# Altium schematic sheet SC945D_SD_Card.SchDoc: SD Card
size 393 x 270 mm; CompanyName: Seccom; Address1: 521, rue du capt. François Garbit; Address2: 69440 Mornant; Address3: seccom@seccom.fr; Address4: www.seccom.fr; DocumentNumber: 5; SheetNumber: 5; SheetTotal: 9; PageSetup: Record=PageOptions|CenterHorizontal=True|CenterVertical=True|PrintScale=0.74|XCorrection=1.00|YCorrection=1.00|PrintKind=0|BorderSize=5000000|LeftOffset=0|BottomOffset=0|Orientation=2|PaperLength=1000|PaperWidth=1000|Scale=100|PaperSource=7|PrintQuality=-4|MediaType=1|DitherType=10|PaperKind=A4|PrintScaleMode=1
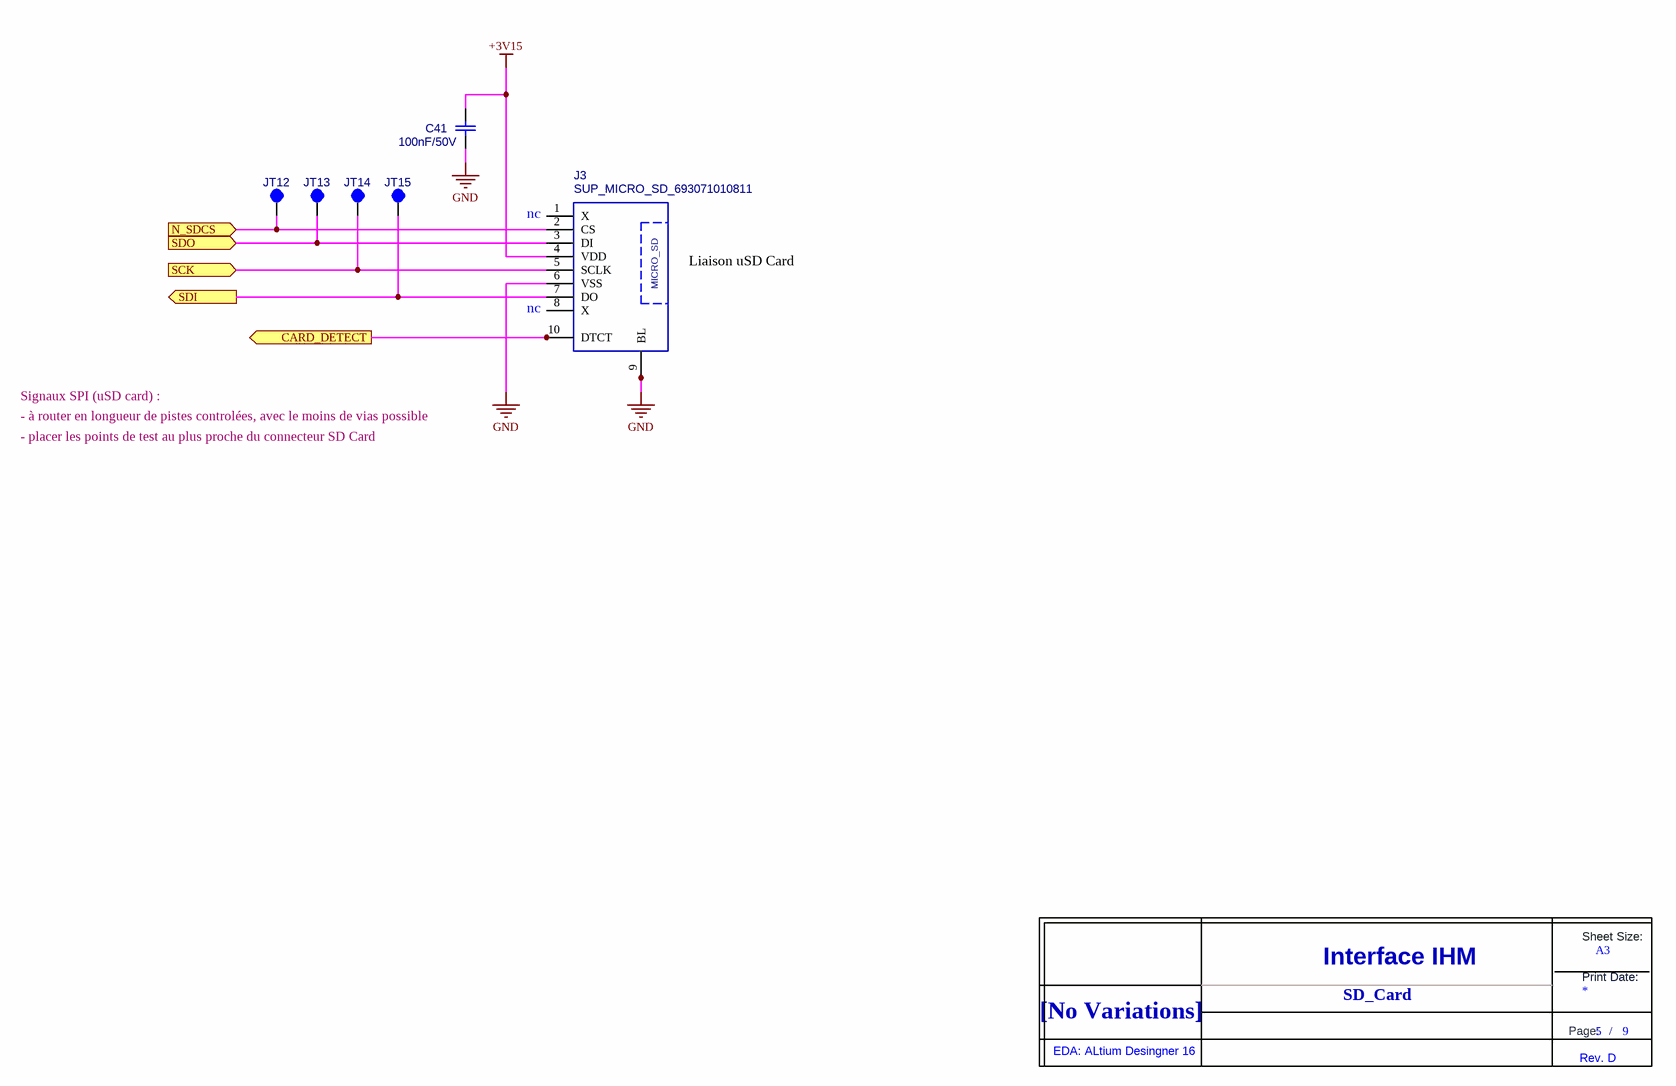
[diagram p0: SC945D_SD_Card.SchDoc]

## Parts
C41  value 100nF/50V  [0603_ReflowSoldering_CAP]  (hidden comment: C_0603_X7R_10%_100N-50V)
J3  value SUP_MICRO_SD_693071010811  [SUP_MICRO_SD_BL_PUSH-PUSH_693071010811+USD]  (hidden comment: SUP_MICRO_SD_CARD_BL_PUSH-PUSH_693071010811)
JT12  PAD_CMS_20X20_E  [PAD_CMS_20X20_E]  (value not drawn)  (no BOM)
JT13  PAD_CMS_20X20_E  [PAD_CMS_20X20_E]  (value not drawn)  (no BOM)
JT14  PAD_CMS_20X20_E  [PAD_CMS_20X20_E]  (value not drawn)  (no BOM)
JT15  PAD_CMS_20X20_E  [PAD_CMS_20X20_E]  (value not drawn)  (no BOM)
Title_new?  DNI  (value not drawn)  (graphical)

## Ports
CARD_DETECT (out), N_SDCS (in), SCK (in), SDI (out), SDO (in)

## Nets
+3V15: C41.2 J3.4(VDD)
GND: C41.1 J3.6(VSS) J3.9(BL) J3.9A(BL)
CARD_DETECT: J3.10(DTCT) J3.10A(DTCT) ; port CARD_DETECT
N_SDCS: J3.2(CS) JT12.1 ; port N_SDCS
SCK: J3.5(SCLK) JT14.1 ; port SCK
SDI: J3.7(DO) JT15.1 ; port SDI
SDO: J3.3(DI) JT13.1 ; port SDO

Not connected (* = marked no-connect by the designer): J3 1(X) 8(X)

## Notes on the sheet
- (near J3) nc
- (near J3) Liaison uSD Card
- - placer les points de test au plus proche du connecteur SD Card
- Signaux SPI (uSD card) :
- - à router en longueur de pistes controlées, avec le moins de vias possible
- SD_Card
- (in symbol SUP_MICRO_SD_CARD_BL_PUSH-PUSH_693071010811) MICRO_SD
- (in symbol Title_new) Sheet Size:; A3; Interface IHM; Print Date:; [No Variations]; Page:; /; EDA: ALtium Desingner 16; Rev. D

## Library data of the parts
C41 = C_0603_X7R_10%_100N-50V: Condensateur céramique, X7R, 10%, CMS 0603, 100nF/50V; Creation: FB (29/02/12); Boitier: 0603; Remarque: {Remarque}; Fabricant: Kemet; Ref Fab: C0603C104K5RAC; Coeff: 1; ComponentLink1URL: O:\_Documentation\Datasheets\Kemet\Condos_Ceramic_CMS.pdf; ComponentLink2URL: o:\_Documentation\Datasheets\_BOITIERS\PASSIF_CMS\; Config: *; ComponentLink1Description: Datasheet; ComponentLink2Description: Datasheet Boitier; Supplier 1: Farnell; Supplier Part Number 1: 1288255
J3 = SUP_MICRO_SD_CARD_BL_PUSH-PUSH_693071010811: Embase pour Micro SD Card, 8 points, blindée, fixation Push-Push, noir, -25/+85°C, CMS; Creation: FB (05/03/12); Boitier: 14x15.2+1.7mm_h1.98mm; Fabricant: Wurth Elektronik; Coeff: 1; Ref Fab: 693071010811; ComponentLink2URL: o:\_Documentation\Datasheets\_BOITIERS\; Config: *; ComponentLink1URL: O:\_Documentation\Datasheets\Wurth_Elektronik\693071010811.pdf; ComponentLink1Description: Datasheet; ComponentLink2Description: Datasheet Boitier; Supplier 1: Farnell; Supplier Part Number 1: 2081363
JT12-JT15 = PAD_CMS_20X20_E: Pad en surface, CMS; Creation: LJ; Reference: {Reference}; Value: PAD CMS; Remarque: {Remarque}; Verification: LJ (03/12/02); Coeff: 0; Fabricant: {Fabricant}; Ref Fab: {Ref Fab}; Boitier: PAD_CMS_20X20_E; ComponentLink1URL: o:\_Documentation\Datasheets; ComponentLink2URL: o:\_Documentation\Datasheets\_BOITIERS\; Config: *; ComponentLink1Description: Datasheet; ComponentLink2Description: Datasheet Boitier
Title_new? = Title_new